# EAGLE design PicCan2 (EAGLE 7.5.0)
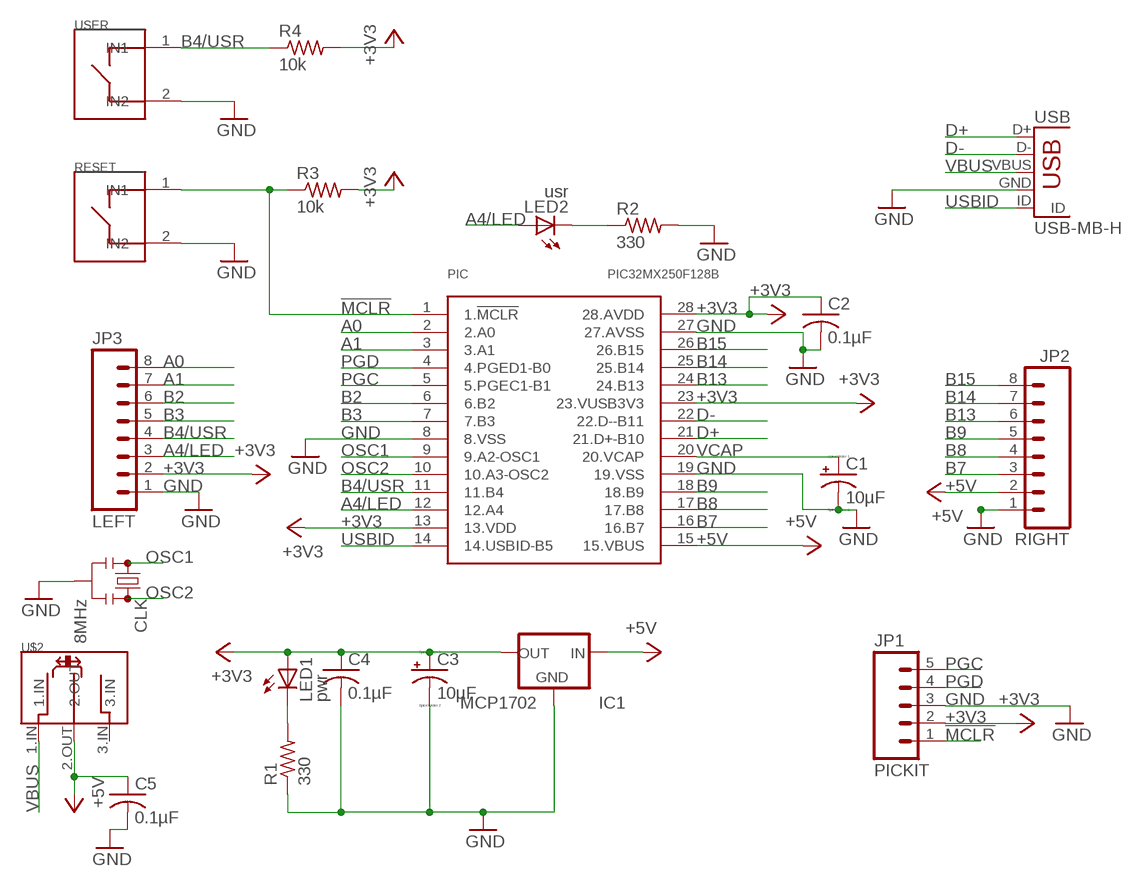
[diagram p0: schematic, sheet 1]

## Parts
C1  10µF  CPOL-USB45181A  [B45181A]
C2  0.1µF  C-US025-025X050  [C025-025X050]
C3  10µF  CPOL-USB45181A  [B45181A]
C4  0.1µF  C-US025-025X050  [C025-025X050]
C5  0.1µF  C-US025-025X050  [C025-025X050]
CLK  8MHz  RESONATORPTH  [RESONATOR-PTH]
IC1  MCP1702  79LXX  [79LXX]
JP1  PICKIT  M05PTH  [1X05]
JP2  RIGHT  M08SILK_FEMALE_PTH  [1X08]
JP3  LEFT  M08SILK_FEMALE_PTH  [1X08]
LED1  pwr  LED3MM  [LED3MM]
LED2  usr  LED3MM  [LED3MM]
PIC  PIC32MX250F128B  [DIL28-3]
R1  330  R-US_0207/10  [0207/10]
R2  330  R-US_0207/10  [0207/10]
R3  10k  R-US_0207/10  [0207/10]
R4  10k  R-US_0207/10  [0207/10]
RESET  PUSHBUTTON  [1X020]
U$2  SLDSWCH  [SLDSWCH]
USB  USB-MB-H  [USB-MB-H]
USER  PUSHBUTTON  [1X020]

## Nets
!MCLR: JP1.1 PIC.1(1.!MCLR) R3.1 RESET.1(IN1)
+3V3: C2.1 C3.+ C4.1 IC1.OUT JP1.2 JP3.2 LED1.A PIC.13(13.VDD) PIC.23(23.VUSB3V3) PIC.28(28.AVDD) R3.2 R4.2
+5V: C5.1 IC1.IN JP2.2 PIC.15(15.VBUS) U$2.2.OUT
A0: JP3.8 PIC.2(2.A0)
A1: JP3.7 PIC.3(3.A1)
A4/LED: JP3.3 LED2.A PIC.12(12.A4)
B2: JP3.6 PIC.6(6.B2)
B3: JP3.5 PIC.7(7.B3)
B4/USR: JP3.4 PIC.11(11.B4) R4.1 USER.1(IN1)
B7: JP2.3 PIC.16(16.B7)
B8: JP2.4 PIC.17(17.B8)
B9: JP2.5 PIC.18(18.B9)
B13: JP2.6 PIC.24(24.B13)
B14: JP2.7 PIC.25(25.B14)
B15: JP2.8 PIC.26(26.B15)
D+: PIC.21(21.D+-B10) USB.D+
D-: PIC.22(22.D--B11) USB.D-
GND: C1.- C2.2 C3.- C4.2 C5.2 CLK.2 IC1.GND JP1.3 JP2.1 JP3.1 PIC.8(8.VSS) PIC.19(19.VSS) PIC.27(27.AVSS) R1.1 R2.2 RESET.2(IN2) USB.GND USER.2(IN2)
N$1: LED2.K(C) R2.1
N$4: LED1.K(C) R1.2
OSC1: CLK.1 PIC.9(9.A2-OSC1)
OSC2: CLK.3 PIC.10(10.A3-OSC2)
PGC: JP1.5 PIC.5(5.PGEC1-B1)
PGD: JP1.4 PIC.4(4.PGED1-B0)
USBID: PIC.14(14.USBID-B5) USB.ID
VBUS: U$2.1.IN USB.VBUS
VCAP: C1.+ PIC.20(20.VCAP)
Unconnected: U$2.3.IN

## Library data of the parts
C1 C3 = me433:CPOL-US: POLARIZED CAPACITOR, American symbol
C2 C4 C5 = me433:C-US: CAPACITOR, American symbol
CLK = me433:RESONATOR: Resonator Small SMD resonator. Used, eg, on the Arduino Pro/ Pro Mini boards. 8MHz- XTAL-08895 16MHz- XTAL-08900
IC1 = me433:79LXX: VOLTAGE REGULATOR
JP1 = me433:M05: Header 5 Standard 5-pin 0.1" header. Use with straight break away headers (SKU : PRT-00116), right angle break away headers (PRT-00553), swiss pins (PRT-00743), machine pins (PRT-00117), and female headers (PRT-00115). Molex polarized connector foot print use with SKU : PRT-08230 with associated crimp pins and housings.
JP2 JP3 = me433:M08: Header 8 Standard 8-pin 0.1" header. Use with straight break away headers (SKU : PRT-00116), right angle break away headers (PRT-00553), swiss pins (PRT-00743), machine pins (PRT-00117), and female headers (PRT-00115).; PROD_ID: CONN-08438
LED1 LED2 = me433:LED: LED OSRAM: - CHIPLED LG R971, LG N971, LY N971, LG Q971, LY Q971, LO R971, LY R971 LH N974, LH R974 LS Q976, LO Q976, LY Q976 LO Q996 - Hyper CHIPLED LW Q18S LB Q993, LB Q99A, LB R99A - SideLED LS A670, LO A670, LY A670, LG A670, LP A670 LB A673, LV A673, LT A673, LW A673 LH A674 LY A675 LS A676, LA A676, LO A676, LY A676, LW A676 LS A679, LY A679, LG A679 - Hyper Micro SIDELED® LS Y876, LA Y876, LO Y876, LY Y876 LT Y87S - SmartLED LW L88C, LW L88S LB L89C, LB L89S, LG L890 LS L89K, LO L89K, LY L89K LS L896, LA L896, LO L896, LY L896 - TOPLED LS T670, LO T670, LY T670, LG T670, LP T670 LSG T670, LSP T670, LSY T670, LOP T670, LYG T670 LG T671, LOG T671, LSG T671 LB T673, LV T673, LT T673, LW T673 LH T674 LS T676, LA T676, LO T676, LY T676, LB T676, LH T676, LSB T676, LW T676 LB T67C, LV T67C, LT T67C, LS T67K, LO T67K, LY T67K, LW E67C LS E67B, LA E67B, LO E67B, LY E67B, LB E67C, LV E67C, LT E67C LW T67C LS T679, LY T679, LG T679 LS T770, LO T770, LY T770, LG T770, LP T770 LB T773, LV T773, LT T773, LW T773 LH T774 LS E675, LA E675, LY E675, LS T675 LS T776, LA T776, LO T776, LY T776, LB T776 LHGB T686 LT T68C, LB T68C - Hyper Mini TOPLED® LB M676 - Mini TOPLED Santana® LG M470 LS M47K, LO M47K, LY M47K Source: http://www.osram.convergy.de LUXEON: - LUMILED® LXK2-PW12-R00, LXK2-PW12-S00, LXK2-PW14-U00, LXK2-PW14-V00 LXK2-PM12-R00, LXK2-PM12-S00, LXK2-PM14-U00 LXK2-PE12-Q00, LXK2-PE12-R00, LXK2-PE12-S00, LXK2-PE14-T00, LXK2-PE14-U00 LXK2-PB12-K00, LXK2-PB12-L00, LXK2-PB12-M00, LXK2-PB14-N00, LXK2-PB14-P00, LXK2-PB14-Q00 LXK2-PR12-L00, LXK2-PR12-M00, LXK2-PR14-Q00, LXK2-PR14-R00 LXK2-PD12-Q00, LXK2-PD12-R00, LXK2-PD12-S00 LXK2-PH12-R00, LXK2-PH12-S00 LXK2-PL12-P00, LXK2-PL12-Q00, LXK2-PL12-R00 Source: www.luxeon.com KINGBRIGHT: KA-3528ASYC Source: www.kingbright.com
PIC = me433:PIC32MX250F128B
R1-R4 = me433:R-US_: RESISTOR, American symbol
RESET USER = me433:PUSHBUTTON
U$2 = me433:SLDSWCH
USB = me433:USB: USB Connectors USB-B-PTH is fully proven SKU : PRT-00139/CONN-08278 USB-miniB is fully proven SKU : PRT-00587 USB-A-PCB is untested. USB-A-H is throughly reviewed, but untested. Spark Fun Electronics SKU : PRT-00437 USB-B-SMT is throughly reviewed, but untested. Needs silkscreen touching up. USB-A-S has not been used/tested USB-MB-H has not been used/tested USB-MICROB has been used. CONN-09505

## Board
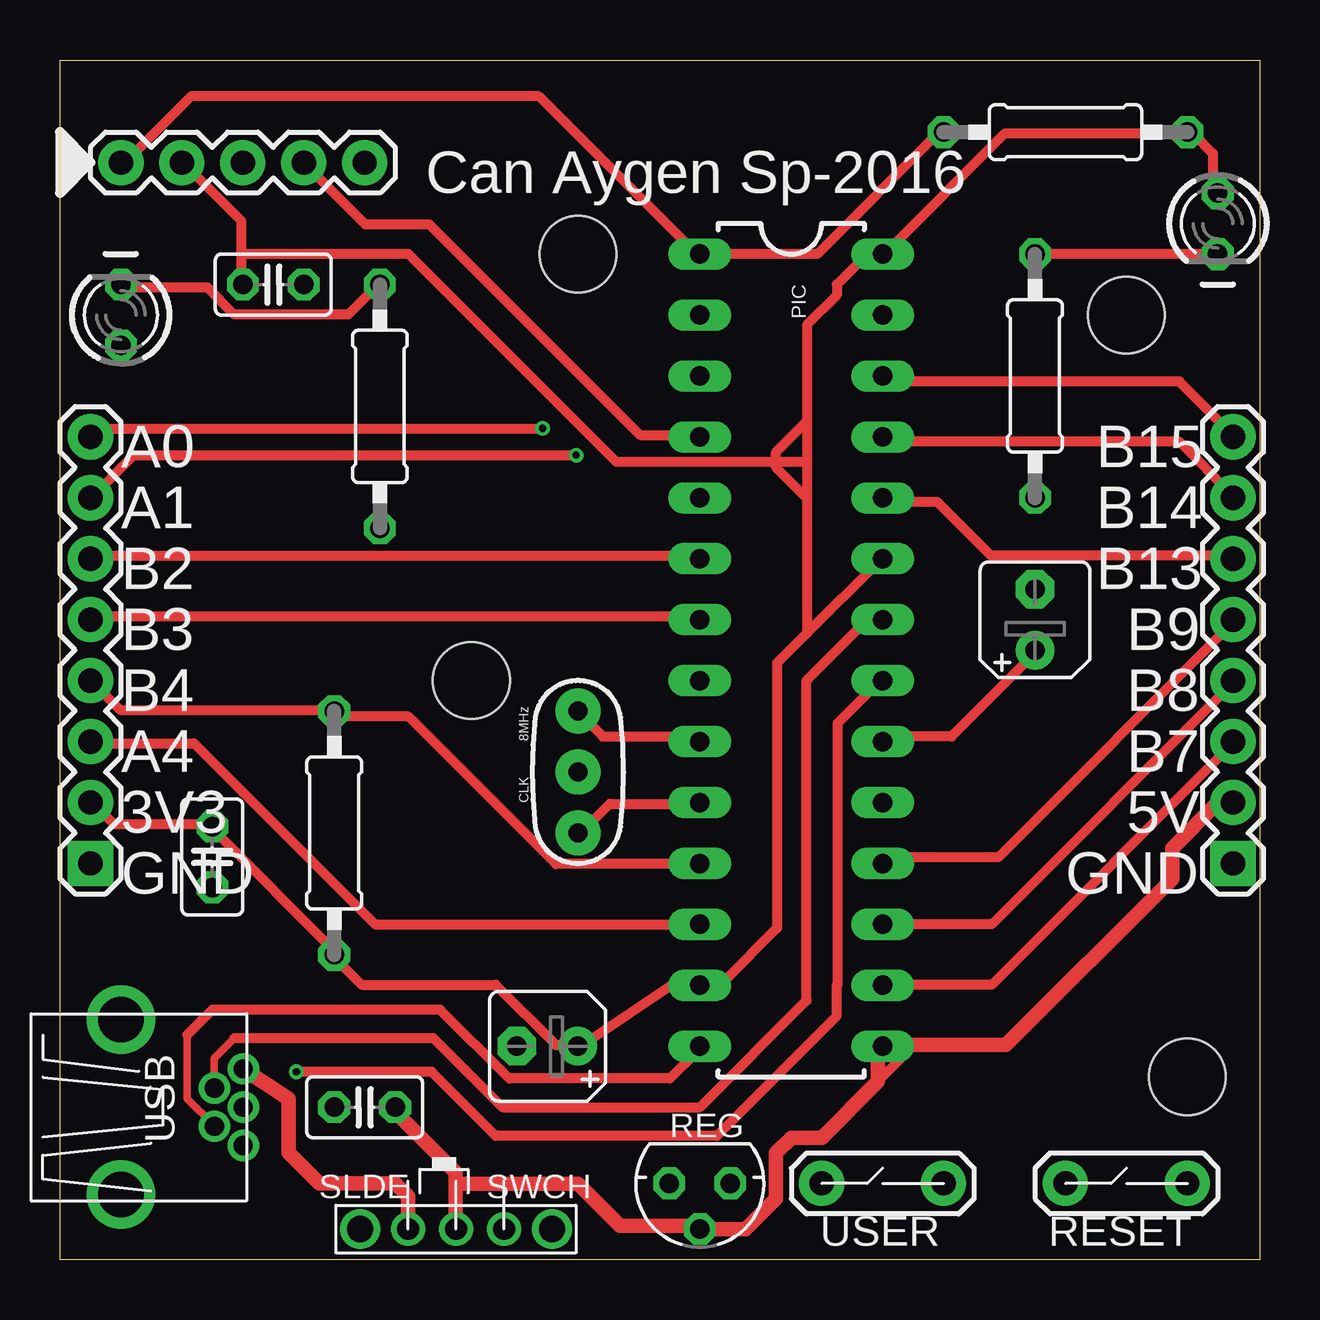
[diagram p1: board, top side]
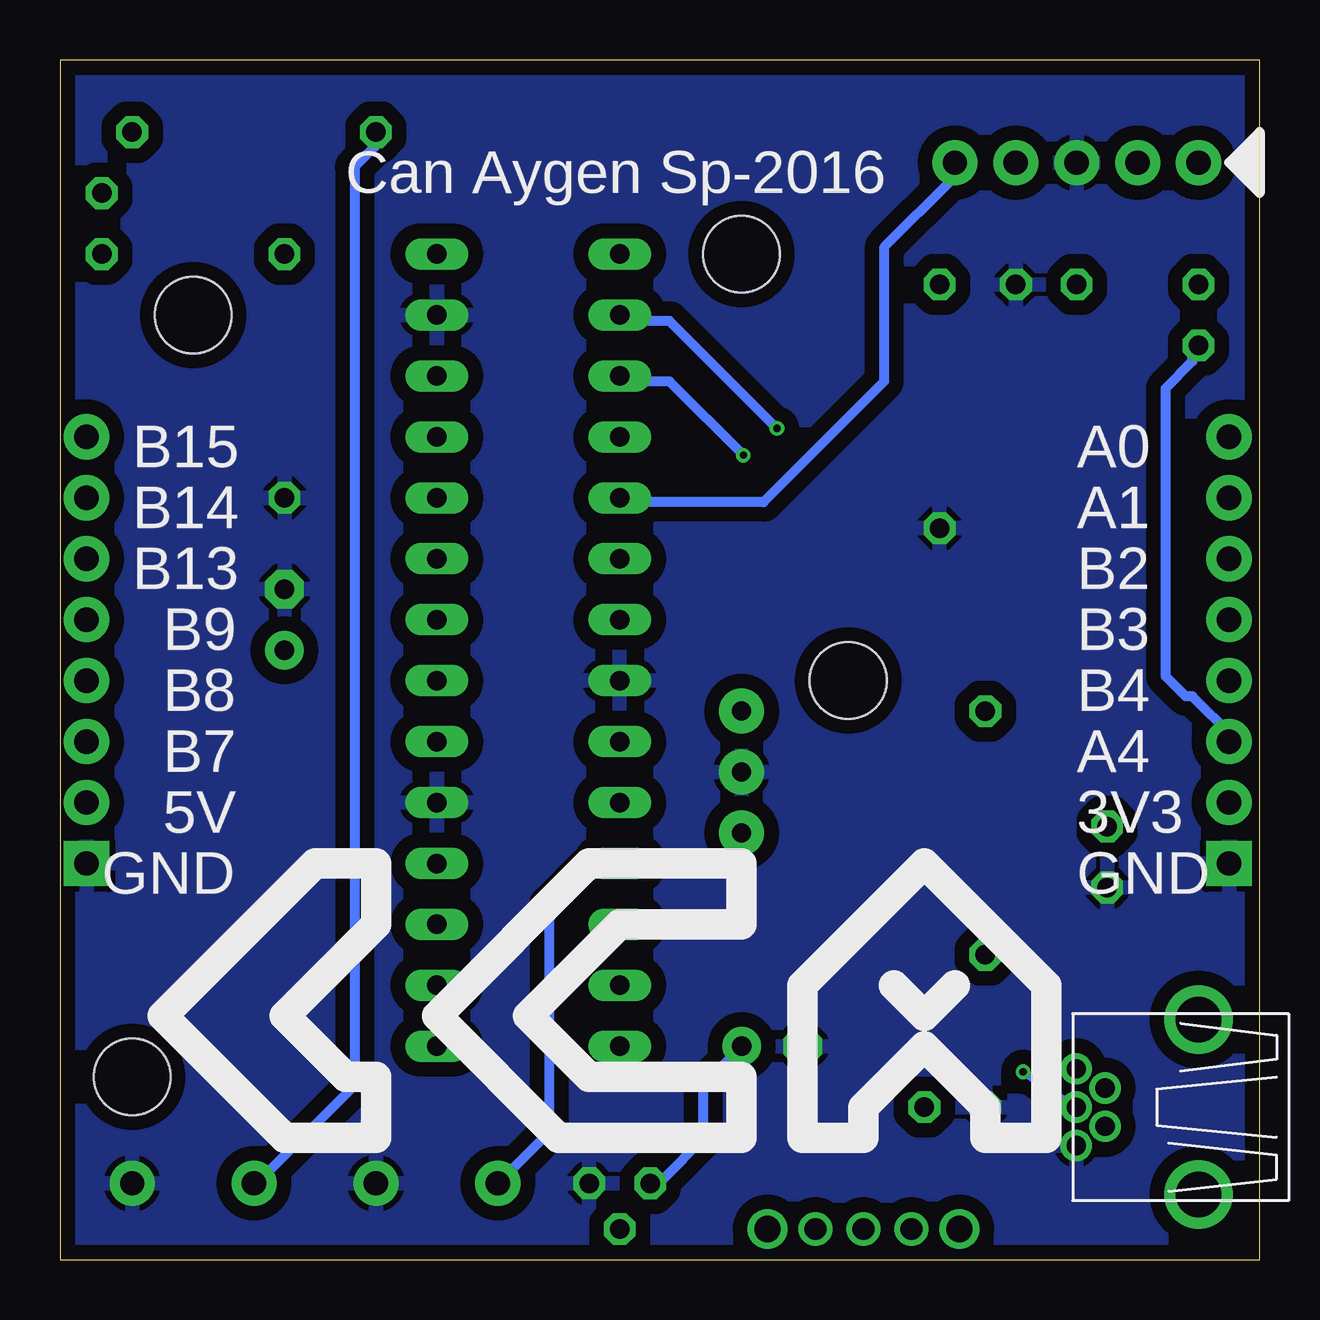
[diagram p2: board, bottom side, seen from below]

Size 50 x 50 mm. Coordinates in mm from the lower left corner, seen from the top.
Outline: 0,0 0,50 50,50 50,0 0,0
Copper layers (1*16): Top 0.035mm / dielectric 1.5mm / Bottom 0.035mm
Design rules "SeeedStudio_2layer_DRU_no_angle_20140221": minimum track width 6mil, minimum drill 12mil, track to track 6mil, track to pad 6mil, pad to pad 6mil, via to via 6mil, smd to smd 0mil, copper to edge 10mil, drill to drill 10mil, minimum pad ring 10mil, minimum via ring 6mil, stop-mask expansion 2mil, vias tented up to drill 100mil, thermal gap 10mil
Holes 3.2 mm at 46.99,7.62 21.59,41.91 44.45,39.37 17.14,24.13

### Footprints (pad centres in the part's own frame; a part is rotated, then mirrored left to right if it is on the bottom)
B45181A = drill 0.813 pad 1.6: + -1.27,0 | drill 0.813 pad 1.6 octagon: - 1.27,0
C025-025X050 = drill 0.813 octagon: 1 -1.27,0; 2 1.27,0
RESONATOR-PTH = drill 0.8 pad 1.88: 1 -2.54,0; 2 0,0; 3 2.54,0
79LXX = drill 0.813 octagon: GND -1.27,0; IN 0,1.905; OUT 1.27,0
1X05 = drill 1.016 pad 1.88: 1 0,0; 2 2.54,0; 3 5.08,0; 4 7.62,0; 5 10.16,0
1X08 = drill 1.016 pad 1.88 square: 1 0,0 | drill 1.016 pad 1.88: 2 2.54,0; 3 5.08,0; 4 7.62,0; 5 10.16,0; 6 12.7,0; 7 15.24,0; 8 17.78,0
LED3MM = drill 0.813 octagon: A -1.27,0; K 1.27,0
DIL28-3 = drill 0.813 long: 1 -16.51,-3.81; 2 -13.97,-3.81; 3 -11.43,-3.81; 4 -8.89,-3.81; 5 -6.35,-3.81; 6 -3.81,-3.81; 7 -1.27,-3.81; 8 1.27,-3.81; 9 3.81,-3.81; 10 6.35,-3.81; 11 8.89,-3.81; 12 11.43,-3.81; 13 13.97,-3.81; 14 16.51,-3.81; 15 16.51,3.81; 16 13.97,3.81; 17 11.43,3.81; 18 8.89,3.81; 19 6.35,3.81; 20 3.81,3.81; 21 1.27,3.81; 22 -1.27,3.81; 23 -3.81,3.81; 24 -6.35,3.81; 25 -8.89,3.81; 26 -11.43,3.81; 27 -13.97,3.81; 28 -16.51,3.81
0207/10 = drill 0.813 octagon: 1 -5.08,0; 2 5.08,0
1X020 = drill 1.016 pad 1.88: 1 0,0; 2 5.08,0
SLDSWCH = drill 1.1: 0.GND -4,0; 4.GND 4,0 | drill 0.9: 1.IN -2,0; 2.OUT 0,0; 3.IN 2,0
USB-MB-H = drill 0.8: D+ 5.1,0; D- 3.9,0.8; GND 5.1,-1.6; ID 3.9,-0.8; VBUS 5.1,1.6 | drill 1.9: P$6 0,-3.65; P$7 0,3.65

### Placement (x,y rotation side)
C1  40.64,26.67 90 top
C2  6.35,16.78 270 top
C3  20.32,8.89 180 top
C4  8.89,40.64 0 top
C5  12.7,6.35 180 top
CLK  21.59,20.32 270 top
IC1  26.67,3.17 180 top
JP1  2.54,45.72 0 top
JP2  48.9,16.51 90 top
JP3  1.27,16.51 90 top
LED1  48.26,43.18 270 top
LED2  2.54,39.37 90 top
PIC  30.48,25.4 270 top
R1  40.64,36.83 90 top
R2  13.34,35.56 270 top
R3  41.91,46.99 0 top
R4  11.43,17.78 270 top
RESET  41.91,3.17 0 top
U$2  16.51,1.27 0 top
USB  2.54,6.35 0 top
USER  31.75,3.17 0 top

### Tracks (layer width: path | path; a pad name or v marks a point on that pad's centre or on a via)
!MCLR
  Top 0.406: R3.1 36.6,46.94 31.57,41.91 PIC.1 26.54,41.91 19.96,48.49 5.46,48.49 2.79,45.82 JP1.1
  Bottom 0.406: RESET.1 41.91,3.35 41.63,3.35 37.72,7.26 37.72,45.54 36.88,46.38 36.88,46.94 R3.1
+3V3
  Top 0.406: LED1.A 48.06,44.7 48.06,46.1 47.22,46.94 R3.2 46.94,46.94 39.4,46.94 34.37,41.91 PIC.28 33.66,41.91 32.38,40.64 32.38,40.21 31.14,38.96 31.14,33.25 | 26.82,11.58 27.66,11.58 29.9,13.82 29.9,24.87 31.14,26.11 | 26.82,11.58 25.7,11.58 21.79,8.94 C3.+ 21.51,8.94 20.68,8.94 18.16,11.46 12.57,11.46 11.46,12.57 R4.2 11.46,12.85 6.43,17.88 C2.1 6.15,18.16 2.23,18.16 1.4,19 JP3.2 | 31.14,26.11 34.09,29.06 PIC.23 | 7.54,41.91 7.54,43.31 5.31,45.54 JP1.2 | 7.54,41.91 7.54,40.79 C4.1 | PIC.13 26.82,11.46 26.82,11.58 | 7.54,41.91 14.53,41.91 23.19,33.25 31.14,33.25 | 31.14,33.25 31.14,26.11
  Bottom 0.406: IC1.OUT 25.15,3.35 24.87,3.35 23.19,5.03 23.19,7.26 22.07,8.38 21.79,8.38 21.51,8.66 C3.+
+5V
  Top 0.406: 16.48,1.4 U$2.2.OUT | 34.09,8.66 PIC.15 34.37,8.94 | 48.9,19 JP2.2 | 26.54,1.4 IC1.IN
  Top 0.61: 16.48,3.15 16.48,3.63 13.97,6.15 C5.1 | 16.48,3.15 16.48,1.4 | 16.48,3.15 21.59,3.15 23.34,1.4 26.54,1.4 | 34.09,8.66 34.09,7.42 31.75,5.08 30.48,5.08 29.84,4.45 29.84,2.54 28.57,1.27 IC1.IN | 34.37,8.94 39.42,8.94 46.35,15.88 46.35,17.14 48.26,19.05 JP2.2
A0  (via drill 0.3)
  Top 0.406: v20.12,34.65 1.68,34.65 1.4,34.37 JP3.8
  Bottom 0.406: v20.12,34.65 24.59,39.12 26.54,39.12 PIC.2
A1  (via drill 0.3)
  Top 0.406: v21.51,33.53 3.07,33.53 1.4,31.85 JP3.7
  Bottom 0.406: v21.51,33.53 24.59,36.6 26.54,36.6 PIC.3
A4/LED
  Top 0.406: PIC.12 13.13,13.97 5.59,21.51 1.4,21.51 JP3.3
  Bottom 0.406: LED2.A 2.79,38 2.79,37.44 3.91,36.32 3.91,24.31 3.07,23.47 2.79,23.47 1.12,21.79 JP3.3
B2
  Top 0.406: PIC.6 26.54,29.34 1.4,29.34 JP3.6
B3
  Top 0.406: PIC.7 26.54,26.82 1.4,26.82 JP3.5
B4/USR
  Top 0.406: JP3.4 1.4,24.03 2.52,22.91 11.18,22.91 R4.1 11.46,22.63 14.53,22.63 20.68,16.48 26.54,16.48 PIC.11
  Bottom 0.406: USER.1 29.62,5.31 29.62,14.81 27.94,16.48 26.82,16.48 PIC.11
B7
  Top 0.406: PIC.16 34.37,11.46 38.84,11.46 48.9,21.51 JP2.3
B8
  Top 0.406: PIC.17 38.84,13.97 48.9,24.03 JP2.4
B9
  Top 0.406: PIC.18 34.37,16.76 39.12,16.76 48.9,26.54 JP2.5
B13
  Top 0.406: PIC.24 34.37,31.57 36.58,31.57 38.81,29.34 48.9,29.34 JP2.6
B14
  Top 0.406: PIC.25 34.37,34.09 46.66,34.09 48.9,31.85 JP2.7
B15
  Top 0.406: PIC.26 34.37,36.6 46.66,36.6 48.9,34.37 JP2.8
D+  (via drill 0.3)
  Top 0.406: v9.86,7.82 15.49,7.82 18.16,5.16 27.38,5.16 32.38,10.16 32.38,11.43 32.41,11.46 32.41,22.35 34.09,24.03 PIC.21
  Bottom 0.305: v9.86,7.82 7.82,6.43
  Bottom 0.406: 7.82,6.43 USB.D+
D-
  Top 0.305: 6.43,7.26 6.43,8.38 7.26,9.22
  Top 0.406: 7.26,9.22 15.57,9.22 18.44,6.35 26.67,6.35 31.11,10.79 31.11,24.15 31.14,24.15 33.66,26.67 PIC.22 | 6.43,7.26 USB.D-
GND
  pour Bottom (isolate 0.61): 0,0 50,0 50,50 0,50
N$1
  Top 0.406: 13.13,40.79 R2.1 13.13,40.51 12.01,39.4 7.26,39.4 6.15,40.51 2.79,40.51 LED2.K
N$2
  Top 0.406: 31.11,31.75 29.84,33.02 29.84,33.66 31.11,34.92
N$3
  Top 0.406: 34.29,7.62 35.56,8.89
N$4
  Top 0.406: LED1.K R1.2
OSC1
  Top 0.406: PIC.9 26.54,21.79 22.63,21.79 21.79,22.63 CLK.1
OSC2
  Top 0.406: PIC.10 26.54,19 22.91,19 21.79,17.88 CLK.3
PGC
  Bottom 0.406: PIC.5 26.54,31.57 20.68,31.57 15.65,36.6 15.65,42.19 12.85,44.98 12.85,45.54 JP1.5
PGD
  Top 0.406: JP1.4 12.72,43.16 15.39,43.16 24.18,34.37 26.54,34.37 PIC.4
USBID
  Top 0.305: 6.43,5.59 5.31,6.71 5.31,9.37
  Top 0.406: 6.43,5.59 USB.ID | PIC.14 26.54,8.66 25.43,7.54 18.72,7.54 15.85,10.41 6.35,10.41 5.31,9.37
VBUS
  Top 0.61: U$2.1.IN 14.51,2.63 13.97,3.17 10.79,3.17 9.53,4.45 9.53,6.7 USB.VBUS
VCAP
  Top 0.406: PIC.20 34.37,21.79 37.16,21.79 40.51,25.15 C1.+

### Text on the board
tPlace: Can Aygen Sp-2016 | A0 | B15 | A1 | B14 | B2 | B13 | B3 | B9 | B4 | B8 | A4 | B7 | 3V3 | 5V | GND | GND | REG | SLDE | SWCH
bPlace: Can Aygen Sp-2016 | A0 | B15 | A1 | B14 | B2 | B13 | B3 | B9 | B4 | B8 | A4 | B7 | 3V3 | 5V | GND | GND